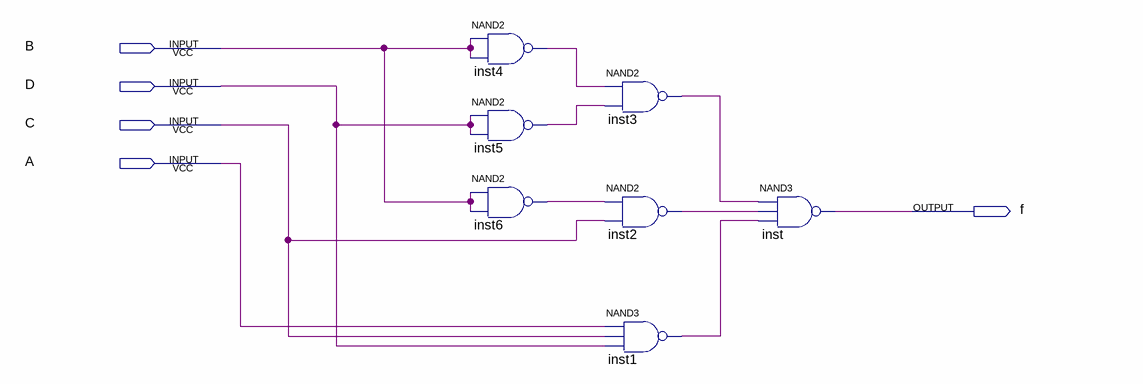
[diagram p0: schematic sheet]
// Quartus schematic Schematic.bdf as structural Verilog: 7 symbols, 5 pins
module Schematic (
  input  B,
  input  D,
  input  C,
  input  A,
  output f
);

  wire inst1_out, inst2_out, inst3_out, inst4_out, inst5_out, inst6_out;

  nand inst4 (inst4_out, B, B);
  nand inst5 (inst5_out, D, D);
  nand inst6 (inst6_out, B, B);
  nand inst3 (inst3_out, inst4_out, inst5_out);
  nand inst2 (inst2_out, inst6_out, C);
  nand inst1 (inst1_out, A, C, D);
  nand inst (f, inst3_out, inst2_out, inst1_out);
endmodule
